# Altium project NODE07 - ENCODER.PrjPcb
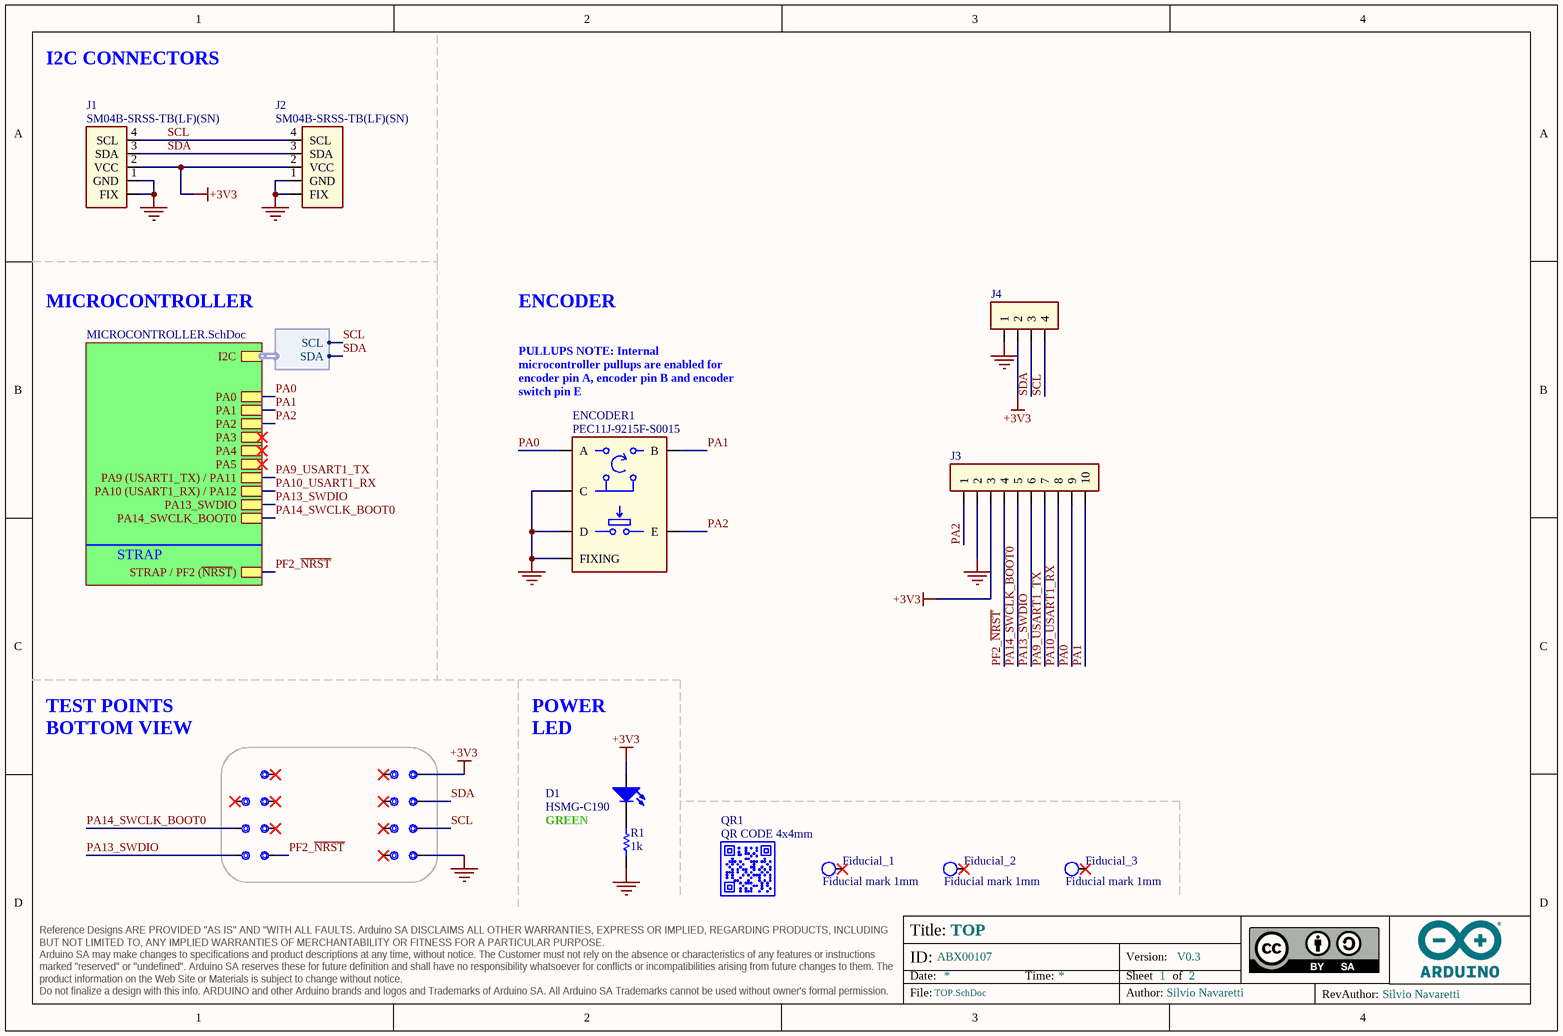
[diagram p0: TOP.SchDoc]
ASSEMBLY_BGA: _; ASSEMBLY_PRESSFIT: _; ASSEMBLY_SMD: X; ASSEMBLY_THT: _; BOARD_CODENAME: NODE07; BOARD_INFO_AUTHOR: Silvio Navaretti; BOARD_INFO_AUTHOR_REV: Silvio Navaretti; BOARD_INFO_Er: _; BOARD_INFO_FLEX: _; BOARD_INFO_FR4: X; BOARD_INFO_FR4_HTG: _; BOARD_INFO_IPC1: _; BOARD_INFO_IPC2: X; BOARD_INFO_IPC3: _; BOARD_INFO_IPC_NA: _; BOARD_INFO_NUMBER_OF_LAYERS: 2; BOARD_INFO_PCB_SIZE: 41.00x25.36mm; BOARD_INFO_POLYMIDE: _; BOARD_INFO_RIGID: X; BOARD_INFO_RIGID/FLEX: _; BOARD_INFO_TBD: _; BOARD_INFO_THICKNESS: 1.6mm; DRILLS_BLIND: _; DRILLS_BURIED: _; DRILLS_COPPER_FILLING: _; DRILLS_FULL: X; DRILLS_LASER: _; DRILLS_PRESSFIT: _; DRILLS_RESIN_FILLING: _; DRILLS_SLOT: _; DRILLS_SOLDER_FILLING: X; FINISH_ADJUSTMENTS: _; FINISH_EDGE_PLATING: _; FINISH_ENIG: _; FINISH_HAL: _; FINISH_HAL_LF: X; FINISH_NI/AU: _; FINISH_SILK_BOTTOM: X; FINISH_SILK_COLOR: WHITE; FINISH_SILK_TOP: X; FINISH_SN/PB: _; FINISH_SOLDERMASK_BOTTOM: X; FINISH_SOLDERMASK_COLOR: BLUE; FINISH_SOLDERMASK_PEELABLE_BOTTOM: _; FINISH_SOLDERMASK_PEELABLE_COLOR: _; FINISH_SOLDERMASK_PEELABLE_TOP: _; FINISH_SOLDERMASK_TOP: X; FINISH_TABS: _; FINISH_TBD: _; INSULATION_MIN_INNER: 0.15mm; INSULATION_MIN_OUTER: 0.15mm; PANEL_MILLING: X; PANEL_NOT_REQUESTED: _; PANEL_NUMBER_OF_FIGURES: 30; PANEL_PROVIDED: X; PANEL_REQUESTED: _; PANEL_SCORING: X; PANEL_SIZE: 262x221mm; PANEL_TABS: _; SKU: ABX00107; TRACK_MIN_WIDTH_INNER: 0.15mm; TRACK_MIN_WIDTH_OUTER: 0.15mm; Version: V0.3; VIA_1: _; VIA_1_HOLE_MM: _; VIA_1_PAD_MM: _; VIA_2: _; VIA_2_HOLE_MM: _; VIA_2_PAD_MM: _; VIA_3: _; VIA_3_HOLE_MM: _; VIA_3_PAD_MM: _; VIA_4: _; VIA_4_HOLE_MM: _; VIA_4_PAD_MM: _; VIA_5: _; VIA_5_HOLE_MM: _; VIA_5_PAD_MM: _; VIA_THROUGH: X; VIA_THROUGH_HOLE_MM: 0.3; VIA_THROUGH_PAD_MM: 0.6
2 sheets, 37 parts. Net scope: hierarchical (ports join the sheet entries above them; power ports are global).
Board file: PCB.PcbDoc
Sheets:
  TOP.SchDoc
    U_MICROCONTROLLER = MICROCONTROLLER.SchDoc

## Sheet TOP.SchDoc: TOP
size A4; Revision: V0.3; SheetNumber: 1; SheetTotal: 2

### Parts
3V3  Test point 1.00mm  [TP-1.00MM]  (value not drawn)  (no BOM)
D1  HSMG-C190  [LEDC1608X80N-AK]
ENCODER1  PEC11J-9215F-S0015  [PEC11J-9215F-S0015]
Fiducial_1  Fiducial mark 1mm  [Fiducial mark 1mm-Footprint-1]  (no BOM)
Fiducial_2  Fiducial mark 1mm  [Fiducial mark 1mm-Footprint-1]  (no BOM)
Fiducial_3  Fiducial mark 1mm  [Fiducial mark 1mm-Footprint-1]  (no BOM)
GND  Test point 1.00mm  [TP-1.00MM]  (value not drawn)  (no BOM)
J1  SM04B-SRSS-TB(LF)(SN)  [SM04B-SRSS-TB(LF)(SN)-Footprint-1]
J2  SM04B-SRSS-TB(LF)(SN)  [SM04B-SRSS-TB(LF)(SN)-Footprint-1]
J3  HEADER TH 2.54mm VERT. 1x010POS  [PIN HEADER 2.54mm VERT. 1x10POS]  (value not drawn)  (no BOM)
J4  HEADER TH 2.54mm VERT. 1x004POS  [PIN HEADER 2.54mm VERT. 1x4POS-Footprint-1]  (value not drawn)  (no BOM)
NRST  Test point 1.00mm  [TP-1.00MM]  (value not drawn)  (no BOM)
PA6  Test point 1.00mm  [TP-1.00MM]  (value not drawn)  (no BOM)
PA7  Test point 1.00mm  [TP-1.00MM]  (value not drawn)  (no BOM)
PC14  Test point 1.00mm  [TP-1.00MM]  (value not drawn)  (no BOM)
PC15  Test point 1.00mm  [TP-1.00MM]  (value not drawn)  (no BOM)
QR1  QR CODE 4x4mm  [QR CODE 4x4mm]  (no BOM)
R1  value 1k  [RES-0402]  (hidden comment: CRCW04021K00FKEDC)
SCL  Test point 1.00mm  [TP-1.00MM]  (value not drawn)  (no BOM)
SDA  Test point 1.00mm  [TP-1.00MM]  (value not drawn)  (no BOM)
SWCLK  Test point 1.00mm  [TP-1.00MM]  (value not drawn)  (no BOM)
SWDIO  Test point 1.00mm  [TP-1.00MM]  (value not drawn)  (no BOM)
TP9  Test point 1.00mm  [TP-1.00MM]  (value not drawn)  (no BOM)
TP10  Test point 1.00mm  [TP-1.00MM]  (value not drawn)  (no BOM)
TP11  Test point 1.00mm  [TP-1.00MM]  (value not drawn)  (no BOM)
TP12  Test point 1.00mm  [TP-1.00MM]  (value not drawn)  (no BOM)

### Sub-sheets
U_MICROCONTROLLER = MICROCONTROLLER.SchDoc: I2C (harness I2C), PA0, PA1, PA2, PA3, PA4, PA5, PA13_SWDIO, PA14_SWCLK_BOOT0, PA9 (USART1_TX) / PA11, PA10 (USART1_RX) / PA12, STRAP / PF2 (~{NRST})

### Harnesses
I2C: SDA, SCL

### Nets
+3V3: 3V3.X D1.A J1.2(VCC) J2.2(VCC) J3.3 J4.2
GND: ENCODER1.C ENCODER1.D ENCODER1.FIXING GND.X J1.1(GND) J1.FIX J2.1(GND) J2.FIX J3.2 J4.1 R1.1
PA0: ENCODER1.A J3.9 ; sheet U_MICROCONTROLLER/PA0
PA1: ENCODER1.B J3.10 ; sheet U_MICROCONTROLLER/PA1
PA2: ENCODER1.E J3.1 ; sheet U_MICROCONTROLLER/PA2
PA9_USART1_TX: J3.7 ; sheet U_MICROCONTROLLER/PA9 (USART1_TX) / PA11
PA10_USART1_RX: J3.8 ; sheet U_MICROCONTROLLER/PA10 (USART1_RX) / PA12
PA13_SWDIO: J3.6 SWCLK.X ; sheet U_MICROCONTROLLER/PA13_SWDIO
PA14_SWCLK_BOOT0: J3.5 SWDIO.X ; sheet U_MICROCONTROLLER/PA14_SWCLK_BOOT0
PF2_~{NRST}: J3.4 NRST.X ; sheet U_MICROCONTROLLER/STRAP / PF2 (~{NRST})
SCL: J1.4(SCL) J2.4(SCL) J4.4 SCL.X ; sheet U_MICROCONTROLLER/I2C.SCL
SDA: J1.3(SDA) J2.3(SDA) J4.3 SDA.X ; sheet U_MICROCONTROLLER/I2C.SDA
NetD1_C: D1.C R1.2

Not connected (* = marked no-connect by the designer): Fiducial_1 1*; Fiducial_2 1*; Fiducial_3 1*; PA6 X*; PA7 X*; PC14 X*; PC15 X*; TP9 X*; TP10 X*; TP11 X*; TP12 X*

### Notes on the sheet
- I2C CONNECTORS
- MICROCONTROLLER
- ENCODER
- PULLUPS NOTE: Internal microcontroller pullups are enabled for encoder pin A, encoder pin B and encoder switch pin E
- STRAP
- TEST POINTS BOTTOM VIEW
- (near D1) POWER LED
- GREEN
- Title:
- ID:
- Date:
- Time:
- Version:
- Sheet
- of
- RevAuthor:
- Reference Designs ARE PROVIDED "AS IS" AND "WITH ALL FAULTS. Arduino SA DISCLAIMS ALL OTHER WARRANTIES, EXPRESS OR IMPLIED, REGARDING PRODUCTS, INCLUDING BUT NOT LIMITED TO, ANY IMPLIED WARRANTIES OF MERCHANTABILITY OR FITNESS FOR A PARTICULAR PURPOSE.
  Arduino SA may make changes to specifications and product descriptions at any time, without notice. The Customer must not rely on the absence or characteristics of any features or instructions marked "reserved" or "undefined". Arduino SA reserves these for future definition and shall have no responsibility whatsoever for conflicts or incompatibilities arising from future changes to them. The product information on the Web Site or Materials is subject to change without notice.
  Do not finalize a design with this info. ARDUINO and other Arduino brands and logos and Trademarks of Arduino SA. All Arduino SA Trademarks cannot be used without owner's formal permission.
- File:
- Author:

### Library data of the parts
3V3 GND NRST PA6 PA7 PC14 PC15 SCL SDA SWCLK SWDIO TP9-TP12 = UT0013-A.6: Manufacturer: This is not a component; Pin Count: 1; Code Arduino: This is not a component; Source: ut.SchLib; Design Item ID: CMP-018-0005-A.3; Part Number: This is not a component
D1 = L0009-A.5: LED SMD 0603 GREEN/568 15mcd 120^; Manufacturer: Broadcom; Code Arduino: 2204; Pin Count: 2; Part Number: HSMG-C190
ENCODER1 = S0054-A.2: ENCODER 2b quadrature, 15PPR, 30 detents, shaft 15mm D-Cut, switch 350+-100gf, SMD 15x18x20mm; Manufacturer: Bourns; Code Arduino: S0054; Part Number: PEC11J-9215F-S0015
Fiducial_1-Fiducial_3 = UT0023-A.7: Fiducial mark 1mm clearance 2mm
J1 J2 = J0005-A.2: CONN JST 4POS SIDE 1MM TIN QWIIC; Code Arduino: J0005; Part Number: SM04B-SRSS-TB(LF)(SN); Manufacturer: JST
J3 = J0169-A.8: Code Arduino: J0169
J4 = J0162-A.5: Code Arduino: J0162
QR1 = QR-0001-A.2: QR CODE 4x4mm on layer 34 (This is not a component); Code Arduino: QRCODE_4x4mm; Part Number: This is not a component; Manufacturer: This is not a component
R1 = R0007-A.24: RES CHIP 0402 1k 1% 1/16W; Manufacturer: Vishay; Code Arduino: 0140; Power: 62.5mW; Temperature coefficient: 100ppm; Part Number: CRCW04021K00FKEDC; Tolerance: 1%; Case Code (Imperial): 0402; Technology: Thick film

## Sheet MICROCONTROLLER.SchDoc: Microcontroller
size A4; SheetNumber: 2; SheetTotal: 2
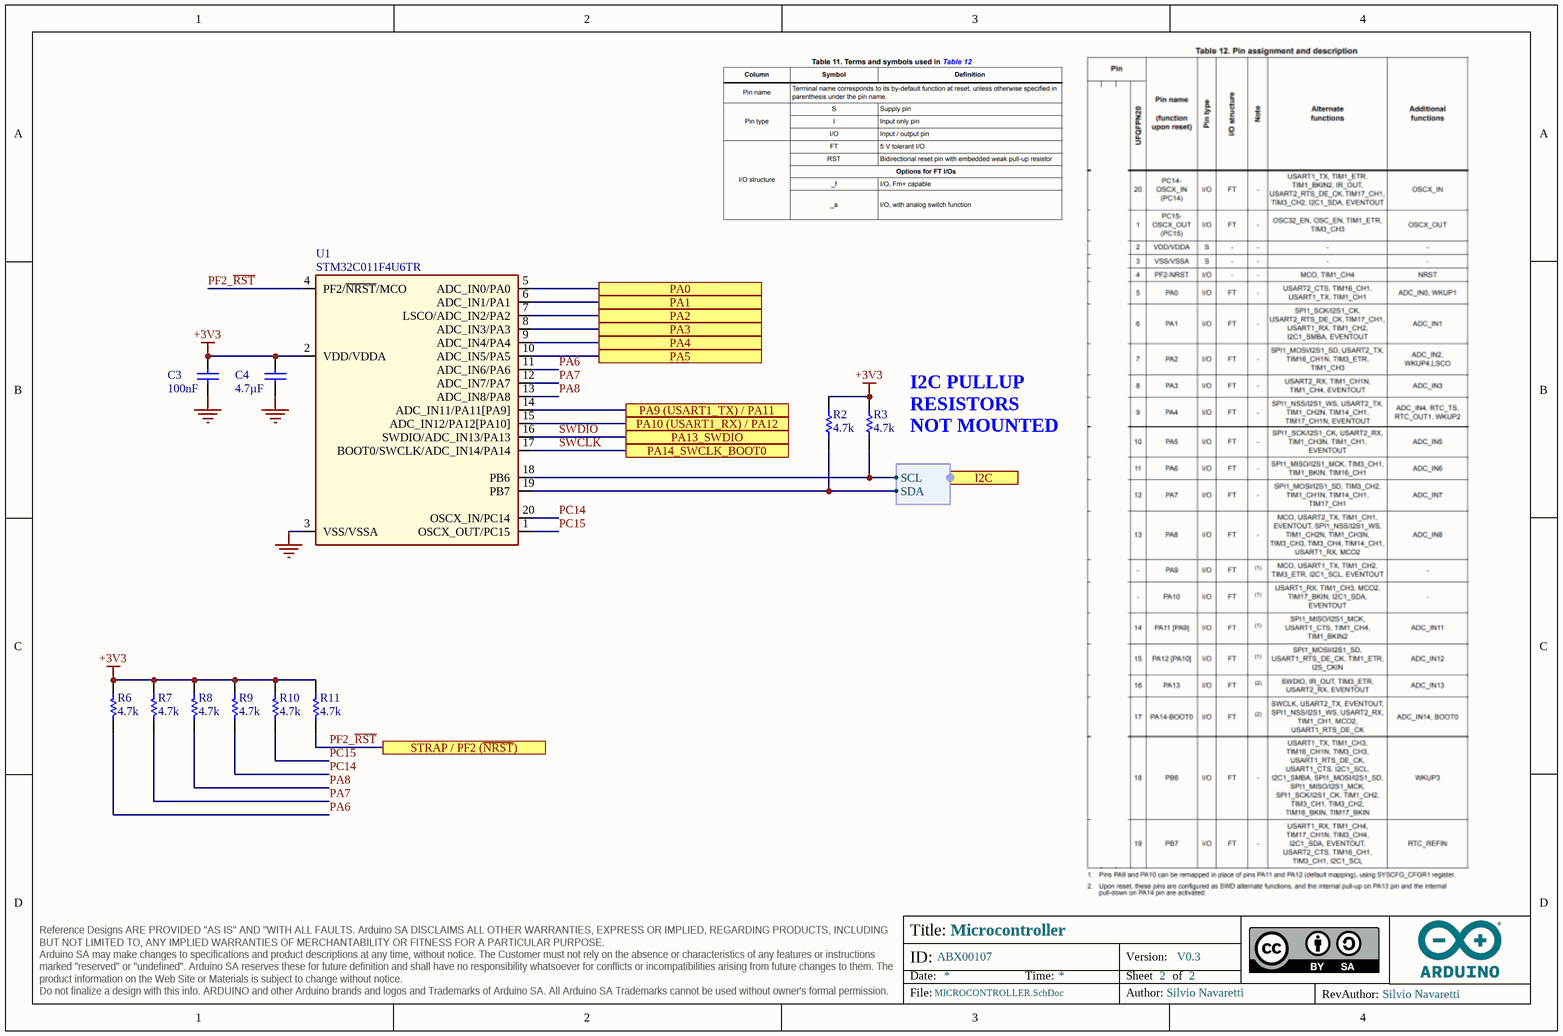
[diagram p1: MICROCONTROLLER.SchDoc]

### Parts
C3  value 100nF  [CAP-0402]  (hidden comment: 0402B104K160CT)
C4  value 4.7µF  [CAP-0603]  (hidden comment: GRM188R61C475KAAJD)
R2  value 4.7k  [RES-0402]  (hidden comment: RC0402FR-074K7L)
R3  value 4.7k  [RES-0402]  (hidden comment: RC0402FR-074K7L)
R6  value 4.7k  [RES-0402]  (hidden comment: RC0402FR-074K7L)
R7  value 4.7k  [RES-0402]  (hidden comment: RC0402FR-074K7L)
R8  value 4.7k  [RES-0402]  (hidden comment: RC0402FR-074K7L)
R9  value 4.7k  [RES-0402]  (hidden comment: RC0402FR-074K7L)
R10  value 4.7k  [RES-0402]  (hidden comment: RC0402FR-074K7L)
R11  value 4.7k  [RES-0402]  (hidden comment: RC0402FR-074K7L)
U1  STM32C011F4U6TR  [UFQFPN20]

### Ports
I2C (harness I2C), PA0, PA1, PA2, PA3, PA4, PA5, PA9 (USART1_TX) / PA11, PA10 (USART1_RX) / PA12, PA13_SWDIO, PA14_SWCLK_BOOT0, STRAP / PF2 (~{NRST})

### Harnesses
I2C: SDA, SCL

### Nets
+3V3: C3.1 C4.2 R2.2 R3.2 R6.1 R7.1 R8.1 R9.1 R10.1 R11.1 U1.2(VDD/VDDA)
GND: C3.2 C4.1 U1.3(VSS/VSSA)
PA0: U1.5(ADC_IN0/PA0) ; port PA0
PA1: U1.6(ADC_IN1/PA1) ; port PA1
PA2: U1.7(LSCO/ADC_IN2/PA2) ; port PA2
PA6: R6.2 U1.11(ADC_IN6/PA6)  [project net PA6_2]
PA7: R7.2 U1.12(ADC_IN7/PA7)  [project net PA7_2]
PA8: R8.2 U1.13(ADC_IN8/PA8)  [project net PA8_2]
PA9_USART1_TX: U1.14(ADC_IN11/PA11[PA9]) ; port PA9 (USART1_TX) / PA11
PA10_USART1_RX: U1.15(ADC_IN12/PA12[PA10]) ; port PA10 (USART1_RX) / PA12
PC14: R9.2 U1.20(OSCX_IN/PC14)  [project net PC14_2]
PC15: R10.2 U1.1(OSCX_OUT/PC15)  [project net PC15_2]
PF2_~{RST}: R11.2 U1.4(PF2/~{NRST}/MCO) ; port STRAP / PF2 (~{NRST})  [project net PF2_~{NRST}]
SCL: R3.1 U1.18(PB6) ; port I2C.SCL
SDA: R2.1 U1.19(PB7) ; port I2C.SDA
SWCLK: U1.17(BOOT0/SWCLK/ADC_IN14/PA14) ; port PA14_SWCLK_BOOT0  [project net PA14_SWCLK_BOOT0]
SWDIO: U1.16(SWDIO/ADC_IN13/PA13) ; port PA13_SWDIO  [project net PA13_SWDIO]
NetU1_8: U1.8(ADC_IN3/PA3) ; port PA3
NetU1_9: U1.9(ADC_IN4/PA4) ; port PA4
NetU1_10: U1.10(ADC_IN5/PA5) ; port PA5

### Notes on the sheet
- (near R3) I2C PULLUP RESISTORS NOT MOUNTED
- Title:
- ID:
- Date:
- Time:
- Version:
- Sheet
- of
- RevAuthor:
- Reference Designs ARE PROVIDED "AS IS" AND "WITH ALL FAULTS. Arduino SA DISCLAIMS ALL OTHER WARRANTIES, EXPRESS OR IMPLIED, REGARDING PRODUCTS, INCLUDING BUT NOT LIMITED TO, ANY IMPLIED WARRANTIES OF MERCHANTABILITY OR FITNESS FOR A PARTICULAR PURPOSE.
  Arduino SA may make changes to specifications and product descriptions at any time, without notice. The Customer must not rely on the absence or characteristics of any features or instructions marked "reserved" or "undefined". Arduino SA reserves these for future definition and shall have no responsibility whatsoever for conflicts or incompatibilities arising from future changes to them. The product information on the Web Site or Materials is subject to change without notice.
  Do not finalize a design with this info. ARDUINO and other Arduino brands and logos and Trademarks of Arduino SA. All Arduino SA Trademarks cannot be used without owner's formal permission.
- File:
- Author:

### Library data of the parts
C3 = C0012-A.15: CAP CHIP 0402 100nF 10% 16V X7R; Manufacturer: Walsin; Code Arduino: 0132; Dielectric: X7R; Part Number: 0402B104K160CT; Tolerance: 10%; Voltage: 16V; Case Code (Imperial): 0402; Technology: Ceramic
C4 = C0054-A.16: CAP CHIP 0603 4.7uF 10% 16V X5R; Manufacturer: Murata; Code Arduino: A5072; Dielectric: X5R; Technology: Ceramic; Part Number: GRM188R61C475KAAJD; Manufacturer 2: Murata; Case Code (Imperial): 0603; Tolerance: 10%; Manufacturer 3: Samsung Electro-Mechanics; Part number 3: CL10A475KO8NNNC; Part number 2: GRM188R61C475KE11D; Voltage: 16V
R2 R3 = R0013-A.24: RES CHIP 0402 4k7 1% 1/16W; Manufacturer: YAGEO; Code Arduino: 2196; Power: 62.5mW; Temperature coefficient: 200ppm; Part Number: RC0402FR-074K7L; Tolerance: 1%; Case Code (Imperial): 0402; Technology: Thick film
R6-R11 = R0013-A.24: RES CHIP 0402 4k7 1% 1/16W; Manufacturer: YAGEO; Power: 62.5mW; Code Arduino: 2196; Temperature coefficient: 200ppm; Tolerance: 1%; Case Code (Imperial): 0402; Part Number: RC0402FR-074K7L; Technology: Thick film
U1 = U0363-A.3: IC Cortex M0, 32b MCU, 32KB Flash, 6KB RAM, VDD 2-3.6V, -40°C to 85°C, QFN20 3x3mm; Manufacturer: ST Microelectronics; Code Arduino: U0363; Part Number: STM32C011F4U6TR

## Nets that join several sheets
+3V3: TOP (6 pins), MICROCONTROLLER (11 pins)
GND: TOP (11 pins), MICROCONTROLLER (C3.2 C4.1 U1.3)
PA0: TOP (ENCODER1.A J3.9), MICROCONTROLLER (U1.5)
PA1: TOP (ENCODER1.B J3.10), MICROCONTROLLER (U1.6)
PA2: TOP (ENCODER1.E J3.1), MICROCONTROLLER (U1.7)
PA9_USART1_TX: TOP (J3.7), MICROCONTROLLER (U1.14)
PA10_USART1_RX: TOP (J3.8), MICROCONTROLLER (U1.15)
PA13_SWDIO: TOP (J3.6 SWCLK.X), MICROCONTROLLER (U1.16)
PA14_SWCLK_BOOT0: TOP (J3.5 SWDIO.X), MICROCONTROLLER (U1.17)
PF2_~{NRST}: TOP (J3.4 NRST.X), MICROCONTROLLER (R11.2 U1.4)
SCL: TOP (J1.4 J2.4 J4.4 SCL.X), MICROCONTROLLER (R3.1 U1.18)
SDA: TOP (J1.3 J2.3 J4.3 SDA.X), MICROCONTROLLER (R2.1 U1.19)

## Assembly variants
ABX00107: not fitted R2 R3 R9